# Altium schematic sheet MotorDriverConnector.SchDoc
size A; SheetNumber: 4; SheetTotal: 8
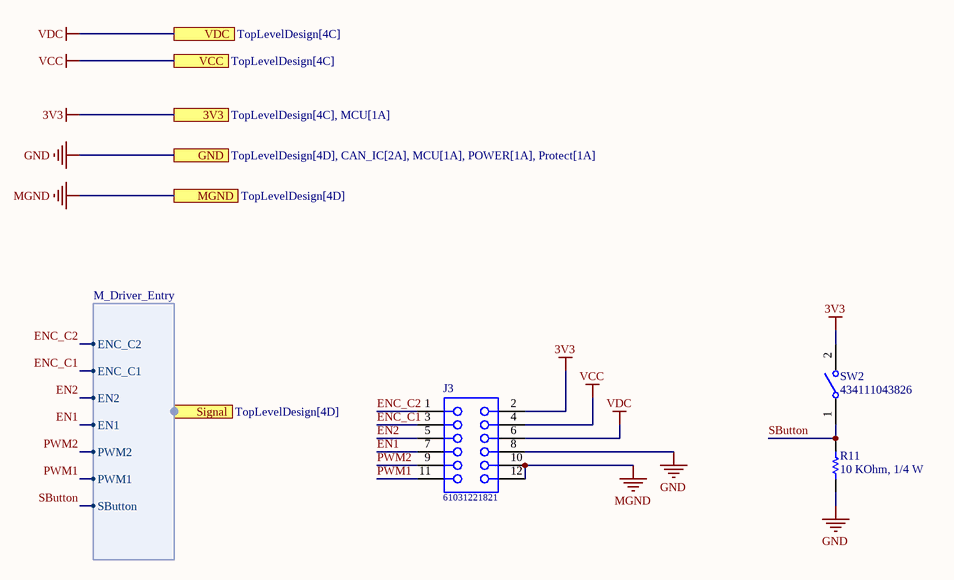
[diagram p0: MotorDriverConnector.SchDoc]

## Parts
J3  61031221821  [61031221821]
R11  value 10 KOhm, 1/4 W  [resistor_0603]  (hidden comment: 0006031031)
SW2  434111043826  [WS-TASV_L6W3.5H4.3_4341x10438x6]

## Ports
3V3 (see TopLevelDesign[4C], MCU[1A]), GND (see TopLevelDesign[4D], CAN_IC[2A], MCU[1A], POWER[1A], Protect[1A]), MGND (see TopLevelDesign[4D]), Signal (harness M_Driver_Entry, see TopLevelDesign[4D]), VCC (see TopLevelDesign[4C]), VDC (see TopLevelDesign[4C])

## Harnesses
M_Driver_Entry: ENC_C2, ENC_C1, EN2, EN1, PWM2, PWM1, SButton

## Nets
3V3: J3.2 SW2.2 ; port 3V3
GND: J3.8 R11.1 ; port GND
MGND: J3.10 J3.12 ; port MGND
VCC: J3.4 ; port VCC
VDC: J3.6 ; port VDC
EN1: J3.7 ; port Signal.EN1
EN2: J3.5 ; port Signal.EN2
ENC_C1: J3.3 ; port Signal.ENC_C1
ENC_C2: J3.1 ; port Signal.ENC_C2
PWM1: J3.11 ; port Signal.PWM1
PWM2: J3.9 ; port Signal.PWM2
SButton: R11.2 SW2.1 ; port Signal.SButton

## Library data of the parts
J3 = CMP-002-00449-1: WR-PHD Socket Header, SMT, pitch 2.54mm, Dual Row, Vertical, 12p; Manufacturer: Wurth Elektronik; Pin Number: 12; Withstanding Voltage: 600VAC; Working Voltage: 250VAC; Contact Resistance: 20mOhm; Rated Current: 3A; System: Connector; Supplier 2 Name: Digi-Key; Operating Temperature: -40 to +105degC; Component Type: Standard; Source: WR-PHD_Socket Header_2.54mm.SchLib; Supplier 1 URL: https://www.mouser.vn/ProductDetail/Wurth-Elektronik/61031221821?qs=Cb2nCFKsA8qsJuA9v2g26A%3D%3D; Row Number: Dual; ComponentLink3Description: Global Supply; ComponentLink2Description: Datasheet; Supplier 2 SN: N/A; Gender: Socket Header; Supplier 3 URL: N/A; Pitch: 2.54mm; ComponentLink4Description: Global Supply; Supplier 1 SN: 710-61031221821; Packaging: Tape and Reel; Supplier 3 SN: N/A; Pins: 12; Design Item ID: 61031221821; ComponentLink1Description: Manufacturer; ComponentLink1URL: http://www.we-online.de; Manufacturer Part Number: 61031221821; Published Date: May 2020; ComponentLink3URL: https://www.we-online.com/en/components/products/PHD_2_54_SMT_DUAL_SOCKET_HEADER_6100XX21821?sq=61031221821#61031221821; Orientation: Vertical; ComponentLink2URL: https://www.we-online.com/catalog/datasheet/61031221821.pdf; Supplier 3 Name: thegioiic; ComponentLink4URL: https://www.mouser.vn/ProductDetail/Wurth-Elektronik/61031221821?qs=Cb2nCFKsA8qsJuA9v2g26A%3D%3D; Supplier 1 Name: Mouser; Mounting Technology: SMT; Supplier 2 URL: N/A
R11 = CMP-009-00188-1: RES, size 0603, 10 KOhm, 1/4 W; Manufacture  Name: OEM; Rated Power: 1/4 W; Resistance Tolerance: +/-1%; ComponentLink1Description: Datasheet link; Size: 0603; Supplier 2 SN: RHM10KADTR-ND RHM10KADCT-ND RHM10KADDKR-ND; Mounting Technology: SMT; ComponentLink2URL: N/A; Design Item ID: 0006031031; Supplier 1 Name: Mouser; Component Type: Standard; Supplier 2 URL: https://www.digikey.com/en/products/detail/rohm-semiconductor/ESR03EZPF1002/1983429; Manufacture  SN: OEM; Supplier 2 Name: Digi-Key; Supplier 3 URL: N/A; Source: Resistor_0603.SchLib; ComponentLink1URL: https://fscdn.rohm.com/en/products/databook/datasheet/passive/resistor/chip_resistor/esr-e.pdf; Pins: 2; ComponentLink3Description: Supplier 2 URL; Supplier 1 URL: https://www.mouser.vn/ProductDetail/ROHM-Semiconductor/ESR03EZPF1002?qs=sGAEpiMZZMvdGkrng054t67Efho1F8r6CDeAsqwFse8%3D; Supplier 1 SN: 755-ESR03EZPF1002; Supplier 3 SN: N/A; ComponentLink3URL: https://www.digikey.com/en/products/detail/rohm-semiconductor/ESR03EZPF1002/1983429; ComponentLink4Description: Supplier 3 URL; Supplier 3 Name: thegioiic; ComponentLink2Description: Supplier 1 URL; ComponentLink4URL: N/A
SW2 = CMP-011-00107-1: WS-TASV SMT Tact Switch, L6 x W3.5 x H4.3mm, 260g, SPST-NO, 12V, 50mA; Manufacturer: Wurth Elektronik; Washable: No; Rated Voltage: 12VDC; Packaging: Tape and Reel; Pins: 2; Category: Tact Switches; Width: 3.5mm; Length: 6mm; Design Item ID: 434111043826; Mount: Surface Mount; Supplier 2 URL: https://www.digikey.com/en/products/detail/w%C3%BCrth-elektronik/434111043826/5209073; Operating Temperature Min: -40°C; Circuit: SPST-NO; Supplier 1 URL: https://www.mouser.vn/ProductDetail/Wurth-Elektronik/434111043826?qs=wr8lucFkNMW3koBfPj4qpQ%3D%3D; Rated Current: 50mA; Supplier 3 SN: N/A; Supplier 1 SN: 710-434111043826; Operation Force: 260g; Supplier 3 Name: Thegioiic; Terminal Material: Copper Alloy; Height: 4.3mm; Component Type: Standard; Supplier 2 SN: 732-7040-2-ND; Supplier 3 URL: N/A; Match Code: WS-TASV; Terminal Plating: Silver; Operating Temperature Max: 85°C; Source: Button.SchLib; Supplier 2 Name: Digi-Key; Manufacturer Part Number: 434111043826; Contact Material: Stainless Steel; Supplier 1 Name: Mouser